# Altium schematic sheet [08]-CAN,INTERPOSER.SchDoc: S32K1_CONTROLLER
size A3; Date: 2/13/2019 7:04:57 PM; SheetNumber: 08; SheetTotal: 11; GateName_1: G$1; SymbolName_1: FRAME_B_L; LibraryName: frames; DeviceSetName: FRAME_B_L; GateName_2: G$2; SymbolName_2: DOCFIELD
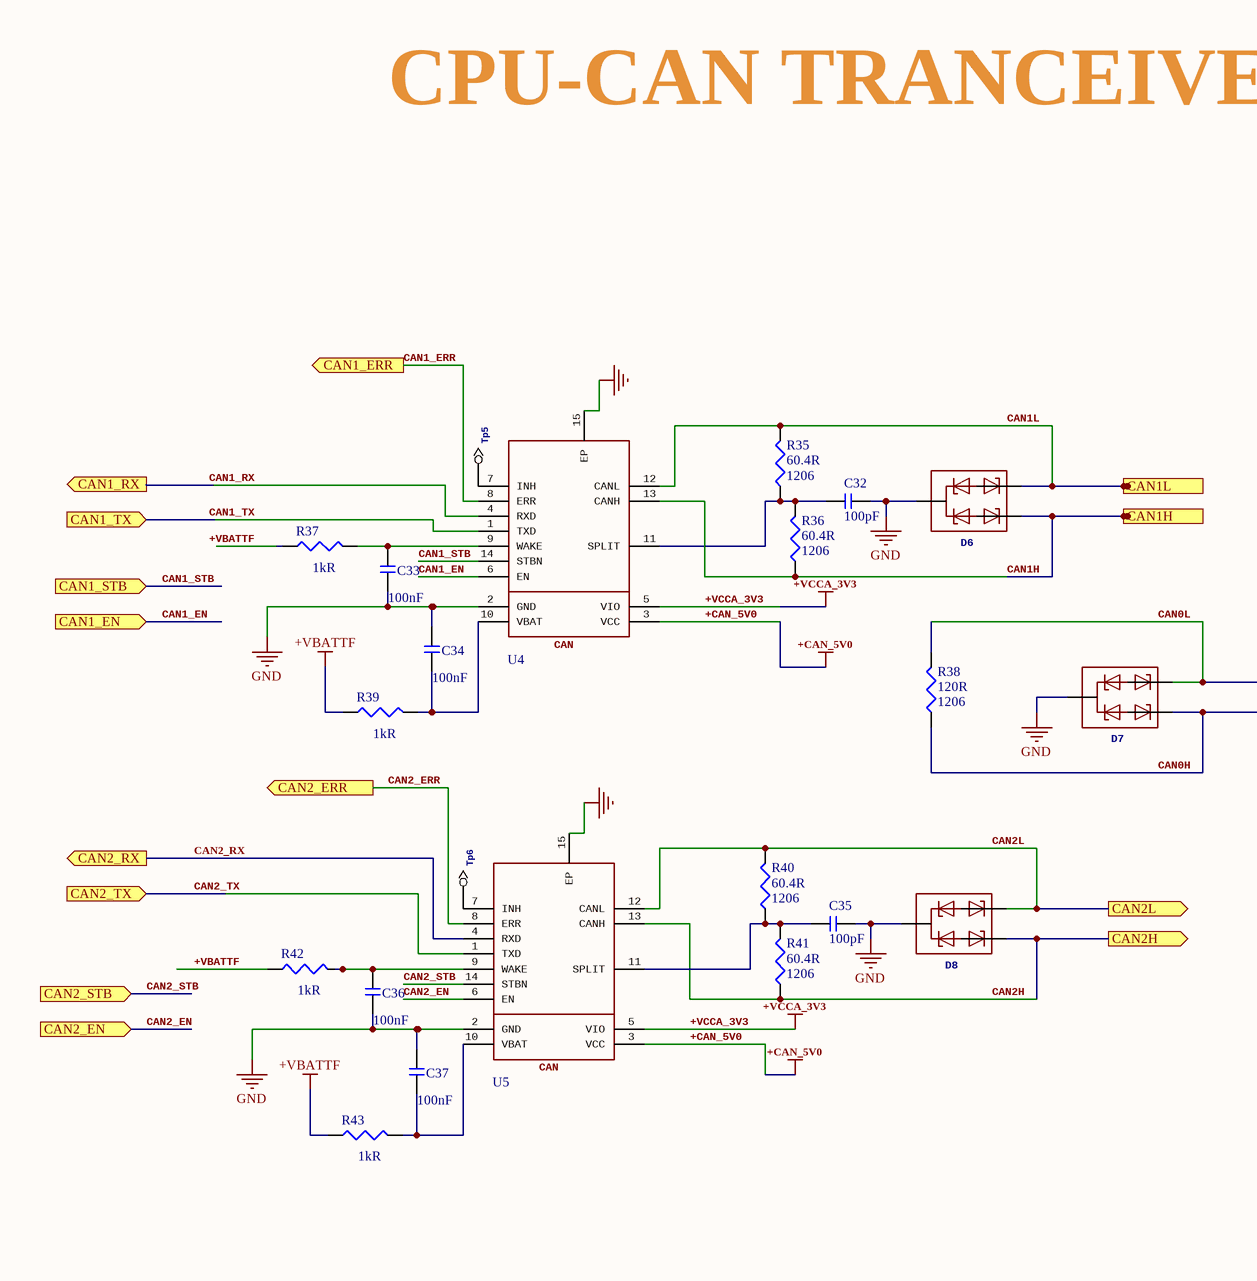
[diagram p0: [08]-CAN,INTERPOSER.SchDoc, left]
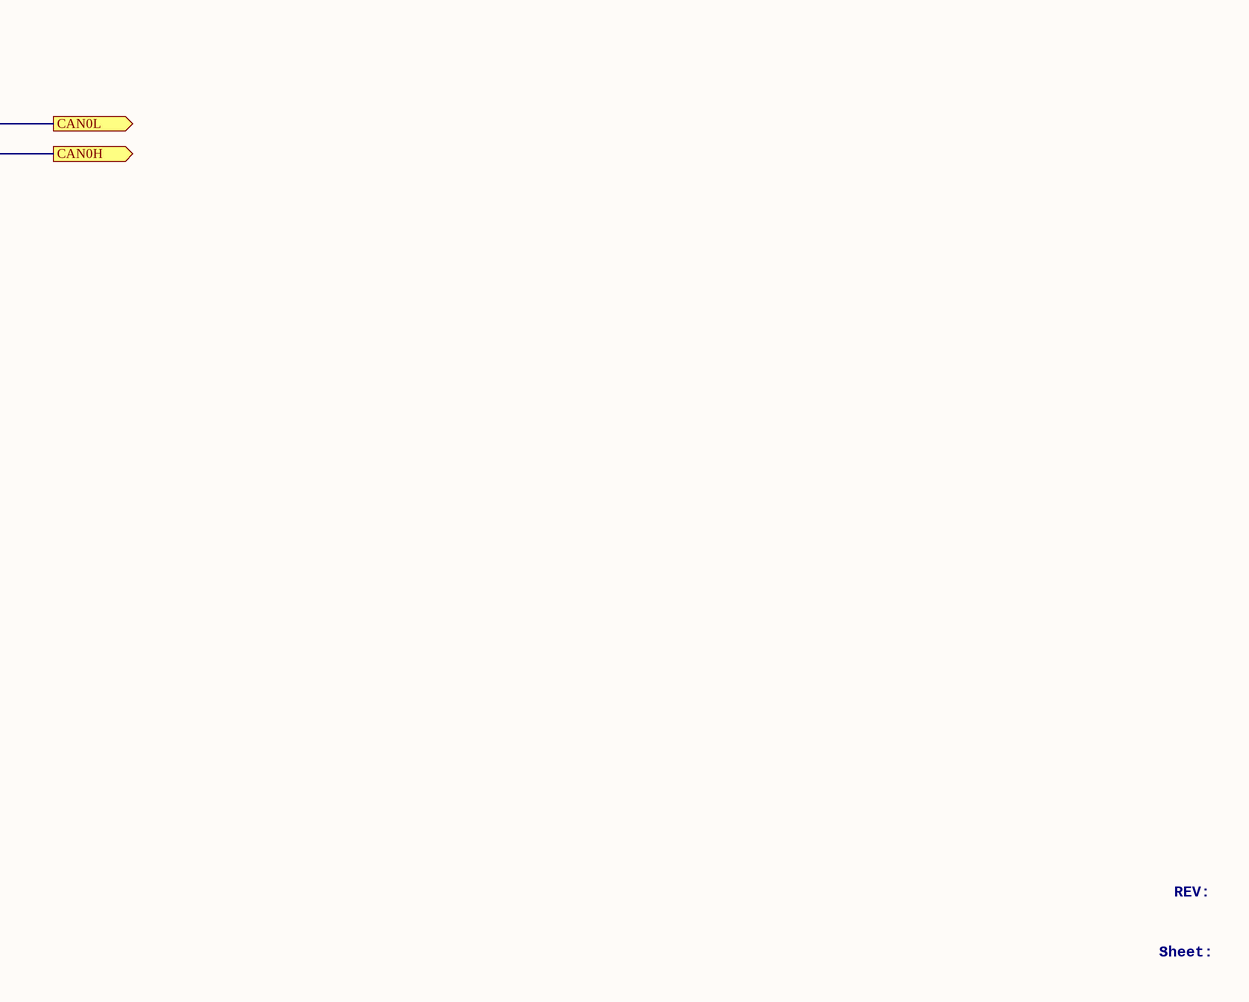
[diagram p1: [08]-CAN,INTERPOSER.SchDoc, right]

## Parts
C32  Capacitance: 100pF  [CAP0402]  (hidden comment: GCM1555C1H101JA16D)
C33  Capacitance: 100nF  [CAP0402]  (hidden comment: GCM155R71C104KA55D)
C34  Capacitance: 100nF  [CAP0402]  (hidden comment: GCM155R71C104KA55D)
C35  Capacitance: 100pF  [CAP0402]  (hidden comment: GCM1555C1H101JA16D)
C36  Capacitance: 100nF  [CAP0402]  (hidden comment: GCM155R71C104KA55D)
C37  Capacitance: 100nF  [CAP0402]  (hidden comment: GCM155R71C104KA55D)
D6  PESD1CAN-U  [PESD1CAN-U_SOT323]  (value not drawn)
D7  PESD1CAN-U  [PESD1CAN-U_SOT323]  (value not drawn)
D8  PESD1CAN-U  [PESD1CAN-U_SOT323]  (value not drawn)
R35  Resistance: 60.4R  Case Code (Imperial): 1206  (hidden comment: RMCF1206FT60R4)
R36  Resistance: 60.4R  Case Code (Imperial): 1206  (hidden comment: RMCF1206FT60R4)
R37  Resistance: 1kR  [RES0402]  (hidden comment: ERJ-2GEJ102X)
R38  Resistance: 120R  Case/Package: 1206  (hidden comment: RMCF1206JT120R)
R39  Resistance: 1kR  [RES0402]  (hidden comment: ERJ-2GEJ102X)
R40  Resistance: 60.4R  Case Code (Imperial): 1206  (hidden comment: RMCF1206FT60R4)
R41  Resistance: 60.4R  Case Code (Imperial): 1206  (hidden comment: RMCF1206FT60R4)
R42  Resistance: 1kR  [RES0402]  (hidden comment: ERJ-2GEJ102X)
R43  Resistance: 1kR  [RES0402]  (hidden comment: ERJ-2GEJ102X)
Tp5  TP  [TestPoint]  (value not drawn)
Tp6  TP  [TestPoint]  (value not drawn)
U4  WEON_TJA1043TK  [WEON_DFN-14_DE]  (value not drawn)
U5  WEON_TJA1043TK  [WEON_DFN-14_DE]  (value not drawn)

## Ports
CAN0H (out), CAN0L (out), CAN1_EN (in), CAN1_ERR (out), CAN1_RX (out), CAN1_STB (in), CAN1_TX (in), CAN1H (out), CAN1L (out), CAN2_EN (in), CAN2_ERR (out), CAN2_RX (out), CAN2_STB (in), CAN2_TX (in), CAN2H (out), CAN2L (out)

## Nets
+CAN_5V0: U4.3(VCC) U5.3(VCC)
+VBATTF: R39.1 R42.1 R43.1
+VCCA_3V3: U4.5(VIO) U5.5(VIO)
GND: C32.2 C33.2 C34.1 C35.2 C36.2 C37.1 D6.3(CK) D7.3(CK) D8.3(CK) U4.2(GND) U4.15(EP) U5.2(GND) U5.15(EP)
CAN0H: D7.2(K2) R38.1 ; port CAN0H
CAN0L: D7.1(K1) R38.2 ; port CAN0L
CAN1_EN: U4.6(EN) ; port CAN1_EN
CAN1_ERR: U4.8(ERR) ; port CAN1_ERR
CAN1_RX: U4.4(RXD) ; port CAN1_RX
CAN1_STB: U4.14(STBN) ; port CAN1_STB
CAN1_TX: U4.1(TXD) ; port CAN1_TX
CAN1H: D6.2(K2) R36.1 U4.13(CANH) ; port CAN1H
CAN1L: D6.1(K1) R35.2 U4.12(CANL) ; port CAN1L
CAN2_EN: U5.6(EN) ; port CAN2_EN
CAN2_ERR: U5.8(ERR) ; port CAN2_ERR
CAN2_RX: U5.4(RXD) ; port CAN2_RX
CAN2_STB: U5.14(STBN) ; port CAN2_STB
CAN2_TX: U5.1(TXD) ; port CAN2_TX
CAN2H: D8.2(K2) R41.1 U5.13(CANH) ; port CAN2H
CAN2L: D8.1(K1) R40.2 U5.12(CANL) ; port CAN2L
NetC32_1: C32.1 R35.1 R36.2 U4.11(SPLIT)
NetC33_1: C33.1 R37.2 U4.9(WAKE)
NetC34_2: C34.2 R39.2 U4.10(VBAT)
NetC35_1: C35.1 R40.1 R41.2 U5.11(SPLIT)
NetC36_1: C36.1 R42.2 U5.9(WAKE)
NetC37_2: C37.2 R43.2 U5.10(VBAT)
NetTp5_1: Tp5.1 U4.7(INH)
NetTp6_1: Tp6.1 U5.7(INH)

Not connected (* = marked no-connect by the designer): R37 1

## Notes on the sheet
- CPU-CAN TRANCEIVER
- (near U4) CAN
- (near U5) CAN
- REV:
- Sheet:
- 3
- Labels drawn without touching a wire or pin: +VBATTF
- Title
- Size:
- Date:
- A3
- Number:
- Time:
- Revision:
- Sheet
- of
- File:

## Library data of the parts
C32 C35 = GCM1555C1H101JA16D: 0402 100 pF 50 V ±5 % Tolerance C0G SMT Multilayer Ceramic Capacitor; Manufacturer: Murata; Tolerance: 5%; Voltage Rating: 50V; Supplier 1: Arrow; Manufacturer Part Number: GCM1555C1H101JA16D; Stock 1: 565000; Pricing 1: 10000 = 0.02080, 1 = 0.01380 (USD); Mount: Surface Mount; Case/Package: 0402; Weight: 0.000212oz; Case Code (Metric): 1005; Case Code (Imperial): 0402; Min Operating Temperature: -55°C; Max Operating Temperature: 125°C; Packaging: Tape and Reel; Dielectric: C0G; Voltage: 50V; Termination: SMD/SMT; Voltage Rating (DC): 50V; Package Quantity: 10000; Length: 1mm; Height: 0.5mm; Width: 0.02inch; Thickness: 0.022inch; Depth: 0.5mm; Ratings: AEC-Q200; Radiation Hardening: No; REACH SVHC: No SVHC; Lead Free: Lead Free; ComponentLink1URL: https://www.verical.com/server-webapp/html/getDatasheet?partID=748988&src-supplier=Verical; ComponentLink1Description: https://www.verical.com/server-webapp/html/getDatasheet?partID=748988&src-supplier=Verical; ComponentLink2URL: http://datasheet.octopart.com/GCM1555C1H101JA16D-Murata-datasheet-46741790.pdf?src-supplier=Element14; ComponentLink2Description: http://datasheet.octopart.com/GCM1555C1H101JA16D-Murata-datasheet-46741790.pdf?src-supplier=Element14; ComponentLink3URL: http://datasheet.octopart.com/GCM1555C1H101JA16D-Murata-datasheet-14404325.pdf?src-supplier=Future+Electronics; ComponentLink3Description: http://datasheet.octopart.com/GCM1555C1H101JA16D-Murata-datasheet-14404325.pdf?src-supplier=Future+Electronics; ComponentLink4URL: http://datasheet.octopart.com/GCM1555C1H101JA16D-Murata-datasheet-42223911.pdf?src-supplier=Future+Electronics; ComponentLink4Description: http://datasheet.octopart.com/GCM1555C1H101JA16D-Murata-datasheet-42223911.pdf?src-supplier=Future+Electronics
C33 C34 C36 C37 = GCM155R71C104KA55D: Multilayer Ceramic Capacitors (MLCC) - SMD/SMT 0402 0.1uF 16volts X7R 10%; Manufacturer: Murata; Voltage Rating: 16V; Supplier 1: Arrow; Manufacturer Part Number: GCM155R71C104KA55D; Stock 1: 10660000; Pricing 1: 10000 = 0.01910, 1 = 0.05560, 10 = 0.04750, 25 = 0.03370, 100 = 0.02190, 250 = 0.02080 (USD); Mount: Surface Mount; Case/Package: 0402; Case Code (Metric): 1005; Case Code (Imperial): 0402; Min Operating Temperature: -55°C; Max Operating Temperature: 125°C; Package Quantity: 1; Tolerance: 10%; Packaging: Tape and Reel; Dielectric: X7R; Voltage Rating (DC): 16V; Termination: SMD/SMT; Voltage: 16V; Length: 1mm; Height: 0.5mm; Width: 0.02inch; Thickness: 0.022inch; Depth: 0.5mm; Ratings: AEC-Q200; Radiation Hardening: No; REACH SVHC: No SVHC; Lead Free: Lead Free; ComponentLink1URL: http://psearch.en.murata.com/capacitor/product/GCM155R71C104KA55%23.pdf?src-supplier=Avnet; ComponentLink1Description: http://psearch.en.murata.com/capacitor/product/GCM155R71C104KA55%23.pdf?src-supplier=Avnet; ComponentLink2URL: http://search.murata.co.jp/Ceramy/image/img/A01X/partnumbering_e_02.pdf?src-supplier=Digi-Key; ComponentLink2Description: http://search.murata.co.jp/Ceramy/image/img/A01X/partnumbering_e_02.pdf?src-supplier=Digi-Key; ComponentLink3URL: http://uk.rs-online.com/webdocs/1423/0900766b81423e06.pdf?src-supplier=RSComponents; ComponentLink3Description: http://uk.rs-online.com/webdocs/1423/0900766b81423e06.pdf?src-supplier=RSComponents; ComponentLink4URL: https://www.verical.com/server-webapp/html/getDatasheet?partID=220774&src-supplier=Verical; ComponentLink4Description: https://www.verical.com/server-webapp/html/getDatasheet?partID=220774&src-supplier=Verical; ComponentLink5URL: http://datasheet.octopart.com/GCM155R71C104KA55D-Murata-datasheet-11777063.pdf?src-supplier=_legacy+Avnet; ComponentLink5Description: http://datasheet.octopart.com/GCM155R71C104KA55D-Murata-datasheet-11777063.pdf?src-supplier=_legacy+Avnet; ComponentLink6URL: http://datasheet.octopart.com/GCM155R71C104KA55D-Murata-datasheet-14404342.pdf?src-supplier=Future+Electronics; ComponentLink6Description: http://datasheet.octopart.com/GCM155R71C104KA55D-Murata-datasheet-14404342.pdf?src-supplier=Future+Electronics; ComponentLink7URL: http://datasheet.octopart.com/GCM155R71C104KA55D-Murata-datasheet-12515163.pdf?src-supplier=Farnell; ComponentLink7Description: http://datasheet.octopart.com/GCM155R71C104KA55D-Murata-datasheet-12515163.pdf?src-supplier=Farnell; ComponentLink8URL: http://datasheet.octopart.com/GCM155R71C104KA55D-Murata-datasheet-44104237.pdf?src-supplier=Future+Electronics; ComponentLink8Description: http://datasheet.octopart.com/GCM155R71C104KA55D-Murata-datasheet-44104237.pdf?src-supplier=Future+Electronics; ComponentLink9URL: http://datasheet.octopart.com/GCM155R71C104KA55D-Murata-datasheet-62117434.pdf?src-supplier=TME; ComponentLink9Description: http://datasheet.octopart.com/GCM155R71C104KA55D-Murata-datasheet-62117434.pdf?src-supplier=TME; Supplier Part Number 1: GCM155R71C104KA55D
D6-D8 = PESD1CAN-U: CAN bus ESD protection diodeElectroStatic Discharge (ESD) protection diode in a very small SOT323 (SC-70 ) Surface-Mounted Device (SMD) plastic package designed to protect two automotive Controller Area Network (CAN) bus lines from the damage caused by ESD and other transients. AAL Eindhoven MK; GateName_1: G$1; MF: NXP Semiconductors; SymbolName_1: PESD1CAN-U; LibraryName: PESD1CAN-U; DeviceSetName: PESD1CAN-U; AVAILABILITY: Unavailable; MP: PESD1CAN-U; PACKAGE: SOT-323 NXP Semiconductors; PRICE: None
R35 R36 R40 R41 = RMCF1206FT60R4: Res Thick Film 1206 60.4 Ohm 1% 0.25W(1/4W) ±100ppm/C Pad SMD Automotive T/R; Manufacturer: Stackpole Electronics; Max Power Dissipation: 250mW; Temperature Coefficient: 100ppm/°C; Supplier 1: Arrow; Manufacturer Part Number: RMCF1206FT60R4; Stock 1: 4650; Pricing 1: 1 = 0.00350, 10 = 0.00340, 100 = 0.00330, 500 = 0.00320, 3000 = 0.00310 (USD); Mount: Surface Mount; Case/Package: 1206; Case Code (Metric): 3216; Contact Plating: Matte,Tin; Min Operating Temperature: -55°C; Max Operating Temperature: 155°C; Tolerance: 1%; Packaging: Tape and Reel; Composition: Thick Film; Number of Terminations: 2; Features: Automotive AEC-Q200; Length: 0.126inch; Height: 0.028inch; Width: 0.063inch; Radiation Hardening: No; ComponentLink1URL: http://datasheet.octopart.com/RMCF1206FT60R4-Stackpole-Electronics-datasheet-10788263.pdf?src-supplier=Stackpole+Electronics; ComponentLink1Description: http://datasheet.octopart.com/RMCF1206FT60R4-Stackpole-Electronics-datasheet-10788263.pdf?src-supplier=Stackpole+Electronics; ComponentLink2URL: http://datasheet.octopart.com/RMCF1206FT60R4-Stackpole-Electronics-datasheet-12534581.pdf?src-supplier=Stackpole+Electronics; ComponentLink2Description: http://datasheet.octopart.com/RMCF1206FT60R4-Stackpole-Electronics-datasheet-12534581.pdf?src-supplier=Stackpole+Electronics; ComponentLink3URL: http://datasheet.octopart.com/RMCF1206FT60R4-Stackpole-Electronics-datasheet-28504820.pdf; ComponentLink3Description: http://datasheet.octopart.com/RMCF1206FT60R4-Stackpole-Electronics-datasheet-28504820.pdf
R37 R39 R42 R43 = ERJ-2GEJ102X: Res Thick Film 0402 1K Ohm 5% 1/10W ±200ppm/°C Molded SMD SMD Punched Carrier T/R; Manufacturer: Panasonic; Voltage Rating: 50V; Power Rating: 100mW; Supplier 1: Arrow; Manufacturer Part Number: ERJ-2GEJ102X; Stock 1: 3660000; Pricing 1: 10000 = 0.00340, 30000 = 0.00280, 100000 = 0.00270, 1 = 0.00280, 25 = 0.00270, 250 = 0.00260, 3000 = 0.00250 (USD); Mount: Surface Mount; Case/Package: 0402; Case Code (Metric): 1005; Case Code (Imperial): 0402; Contact Plating: Tin; Min Operating Temperature: -55°C; Max Operating Temperature: 155°C; Packaging: Tape and Reel; Tolerance: 5%; Package Quantity: 1; Composition: Thick Film; Number of Terminations: 2; Termination: SMD/SMT; Temperature Coefficient: 200ppm/°C; Military Standard: Not; Max Power Dissipation: 100mW; Voltage Rating (DC): 50V; Features: Automotive AEC-Q200; Working Voltage: 50V; Length: 1mm; Height: 0.35mm; Width: 0.02inch; Depth: 0.5mm; Radiation Hardening: No; REACH SVHC: No SVHC; Lead Free: Lead Free; ComponentLink1URL: https://industrial.panasonic.com/cdbs/www-data/pdf/RDA0000/AOA0000C301.pdf?src-supplier=Future+Electronics; ComponentLink1Description: https://industrial.panasonic.com/cdbs/www-data/pdf/RDA0000/AOA0000C301.pdf?src-supplier=Future+Electronics; ComponentLink2URL: http://www.jameco.com/Jameco/Products/ProdDS/1986781.pdf?src-supplier=Jameco; ComponentLink2Description: http://www.jameco.com/Jameco/Products/ProdDS/1986781.pdf?src-supplier=Jameco; ComponentLink3URL: http://www.farnell.com/datasheets/2059623.pdf?src-supplier=Farnell; ComponentLink3Description: http://www.farnell.com/datasheets/2059623.pdf?src-supplier=Farnell; ComponentLink4URL: http://industrial.panasonic.com/www-data/pdf/AOA0000/AOA0000CE1.pdf?src-supplier=Avnet; ComponentLink4Description: http://industrial.panasonic.com/www-data/pdf/AOA0000/AOA0000CE1.pdf?src-supplier=Avnet; ComponentLink5URL: http://www.alliedelec.com/m/d/51cd0790071e1666bdb9d00c57fcf960.pdf?src-supplier=Allied+Electronics; ComponentLink5Description: http://www.alliedelec.com/m/d/51cd0790071e1666bdb9d00c57fcf960.pdf?src-supplier=Allied+Electronics; ComponentLink6URL: http://industrial.panasonic.com/www-data/pdf/AOA0000/AOA0000CE1.pdf?src-supplier=Avnet+Europe; ComponentLink6Description: http://industrial.panasonic.com/www-data/pdf/AOA0000/AOA0000CE1.pdf?src-supplier=Avnet+Europe; ComponentLink7URL: http://www.farnell.com/datasheets/2059623.pdf?src-supplier=Element14; ComponentLink7Description: http://www.farnell.com/datasheets/2059623.pdf?src-supplier=Element14; ComponentLink8URL: http://industrial.panasonic.com/www-data/pdf/AOA0000/AOA0000CE1.pdf?src-supplier=Avnet+Asia; ComponentLink8Description: http://industrial.panasonic.com/www-data/pdf/AOA0000/AOA0000CE1.pdf?src-supplier=Avnet+Asia; ComponentLink9URL: http://datasheet.octopart.com/ERJ-2GEJ102X-Panasonic-datasheet-13266872.pdf?src-supplier=Newark; ComponentLink9Description: http://datasheet.octopart.com/ERJ-2GEJ102X-Panasonic-datasheet-13266872.pdf?src-supplier=Newark; ComponentLink10URL: http://datasheet.octopart.com/ERJ-2GEJ102X-Panasonic-datasheet-5314550.pdf?src-supplier=Jameco; ComponentLink10Description: http://datasheet.octopart.com/ERJ-2GEJ102X-Panasonic-datasheet-5314550.pdf?src-supplier=Jameco; ComponentLink11URL: http://datasheet.octopart.com/ERJ-2GEJ102X-Panasonic-datasheet-61114972.pdf?src-supplier=Newark; ComponentLink11Description: http://datasheet.octopart.com/ERJ-2GEJ102X-Panasonic-datasheet-61114972.pdf?src-supplier=Newark; ComponentLink12URL: http://datasheet.octopart.com/ERJ-2GEJ102X-Panasonic-datasheet-10554283.pdf?src-supplier=Newark; ComponentLink12Description: http://datasheet.octopart.com/ERJ-2GEJ102X-Panasonic-datasheet-10554283.pdf?src-supplier=Newark; ComponentLink13URL: http://datasheet.octopart.com/ERJ-2GEJ102X-Panasonic-datasheet-37173568.pdf?src-supplier=Electro+Sonic; ComponentLink13Description: http://datasheet.octopart.com/ERJ-2GEJ102X-Panasonic-datasheet-37173568.pdf?src-supplier=Electro+Sonic; ComponentLink14URL: http://datasheet.octopart.com/ERJ-2GEJ102X-Panasonic-datasheet-78375410.pdf; ComponentLink14Description: http://datasheet.octopart.com/ERJ-2GEJ102X-Panasonic-datasheet-78375410.pdf; ComponentLink15URL: http://datasheet.octopart.com/ERJ-2GEJ102X-Panasonic-datasheet-118598.pdf?src-supplier=Digi-Key; ComponentLink15Description: http://datasheet.octopart.com/ERJ-2GEJ102X-Panasonic-datasheet-118598.pdf?src-supplier=Digi-Key; ComponentLink16URL: http://datasheet.octopart.com/ERJ-2GEJ102X-Panasonic-datasheet-5313456.pdf?src-supplier=Farnell; ComponentLink16Description: http://datasheet.octopart.com/ERJ-2GEJ102X-Panasonic-datasheet-5313456.pdf?src-supplier=Farnell; ComponentLink17URL: http://datasheet.octopart.com/ERJ-2GEJ102X-Panasonic-datasheet-11480398.pdf?src-supplier=Arrow; ComponentLink17Description: http://datasheet.octopart.com/ERJ-2GEJ102X-Panasonic-datasheet-11480398.pdf?src-supplier=Arrow; ComponentLink18URL: http://datasheet.octopart.com/ERJ-2GEJ102X-Panasonic---ECG-datasheet-15994758.pdf?src-supplier=Farnell; ComponentLink18Description: http://datasheet.octopart.com/ERJ-2GEJ102X-Panasonic---ECG-datasheet-15994758.pdf?src-supplier=Farnell; ComponentLink19URL: http://datasheet.octopart.com/ERJ2GEJ102X-Panasonic-datasheet-27908757.pdf?src-supplier=Electro+Sonic; ComponentLink19Description: http://datasheet.octopart.com/ERJ2GEJ102X-Panasonic-datasheet-27908757.pdf?src-supplier=Electro+Sonic; Supplier Part Number 1: ERJ-2GEJ102X
R38 = RMCF1206JT120R: Res Thick Film 1206 120 Ohm 5% 0.25W(1/4W) ±200ppm/C Pad SMD Automotive T/R; Manufacturer: Stackpole Electronics; Max Power Dissipation: 250mW; Temperature Coefficient: 200ppm/°C; Supplier 1: Arrow; Manufacturer Part Number: RMCF1206JT120R; Stock 1: 10000; Pricing 1: 5000 = 0.00340, 10000 = 0.00310, 25000 = 0.00260, 1 = 0.00260, 25 = 0.00250, 500 = 0.00230 (USD); Mount: Surface Mount; Case Code (Metric): 3216; Case Code (Imperial): 1206; Contact Plating: Matte,Tin; Min Operating Temperature: -55°C; Max Operating Temperature: 155°C; Packaging: Tape and Reel; Tolerance: 5%; Composition: Thick Film; Number of Terminations: 2; Military Standard: Not; Features: Automotive AEC-Q200; Length: 0.126inch; Height: 0.028inch; Width: 0.063inch; Depth: 1.6mm; Radiation Hardening: No; ComponentLink1URL: https://www.verical.com/server-webapp/html/getDatasheet?partID=464227&src-supplier=Verical; ComponentLink1Description: https://www.verical.com/server-webapp/html/getDatasheet?partID=464227&src-supplier=Verical; ComponentLink2URL: http://datasheet.octopart.com/RMCF1206JT120R-Stackpole-Electronics-datasheet-10788263.pdf?src-supplier=Stackpole+Electronics; ComponentLink2Description: http://datasheet.octopart.com/RMCF1206JT120R-Stackpole-Electronics-datasheet-10788263.pdf?src-supplier=Stackpole+Electronics; ComponentLink3URL: http://datasheet.octopart.com/RMCF1206JT120R-Stackpole-Electronics-datasheet-12534581.pdf?src-supplier=Stackpole+Electronics; ComponentLink3Description: http://datasheet.octopart.com/RMCF1206JT120R-Stackpole-Electronics-datasheet-12534581.pdf?src-supplier=Stackpole+Electronics; ComponentLink4URL: http://datasheet.octopart.com/RMCF1206JT120R-Stackpole-Electronics-datasheet-28504820.pdf?src-supplier=Future+Electronics; ComponentLink4Description: http://datasheet.octopart.com/RMCF1206JT120R-Stackpole-Electronics-datasheet-28504820.pdf?src-supplier=Future+Electronics; ComponentLink5URL: http://datasheet.octopart.com/RMCF1206JT120R-Stackpole-Electronics-datasheet-11546843.pdf?src-supplier=Arrow; ComponentLink5Description: http://datasheet.octopart.com/RMCF1206JT120R-Stackpole-Electronics-datasheet-11546843.pdf?src-supplier=Arrow; Supplier Part Number 1: RMCF1206JT120R
Tp5 Tp6 = TP: GateName_1: G$1; TP?: >TP_NAME; SymbolName_1: TP; LibraryName: WeOnReferencePlatform; DeviceSetName: TP
U4 U5 = WEON_TJA1043TK: GateName_1: G$1; SymbolName_1: WEON_TJA1043; LibraryName: WeOnReferenceBoard; DeviceSetName: WEON_TJA1043TK